# Altium schematic sheet DMotor_Schematic_page1.SchDoc
size 420 x 297 mm; Author: Дубатовка В.В.; Address1: Address1; Address2: Address2; Address3: Address3; Address4: Address4; DocumentNumber: АБВГ.123456.001 Э3; SheetNumber: 1; SheetTotal: 3; Scale: 1:1; DocumentType: Схема электрическая принципиальная; FirstReferrence: АБВГ.123456.001
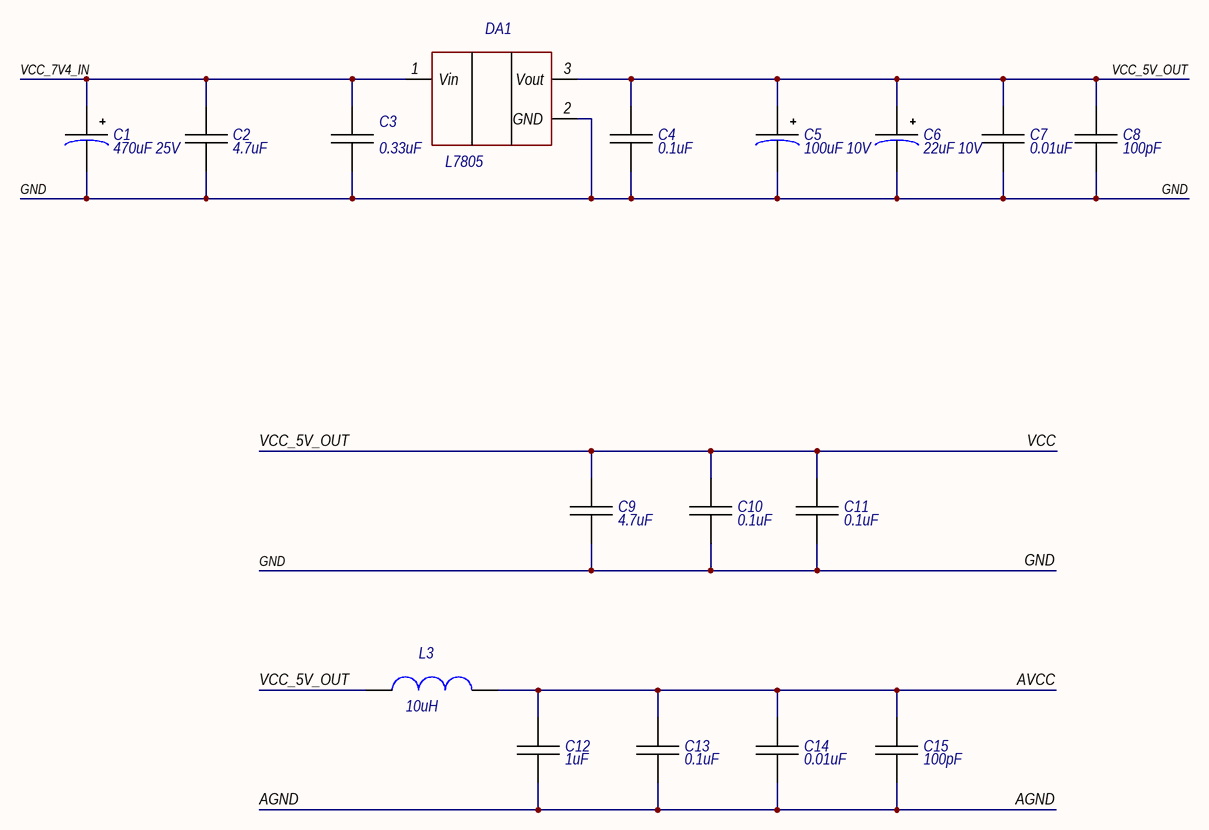
[diagram p0: DMotor_Schematic_page1.SchDoc]

## Parts
C1  470uF 25V  [CapElec_8x16_3.5mm]
C2  4.7uF  [C0603]
C3  0.33uF  [C0603]
C4  0.1uF  [C0603]
C5  100uF 10V  [CapElec_5x11_2mm]
C6  22uF 10V  [TANT-B]
C7  0.01uF  [C0603]
C8  100pF  [C0603]
C9  4.7uF  [C0603]
C10  0.1uF  [C0603]
C11  0.1uF  [C0603]
C12  1uF  [C0603]
C13  0.1uF  [C0603]
C14  0.01uF  [C0603]
C15  100pF  [C0603]
DA1  L7805  [TO-220A]
L3  10uH  [IND1206]

## Nets
AGND: C12.2 C13.2 C14.2 C15.2
AVCC: C12.1 C13.1 C14.1 C15.1 L3.2
GND: C1.2 C2.2 C3.2 C4.2 C5.2 C6.2 C7.2 C8.2 C9.2 C10.2 C11.2 DA1.2(GND)
VCC: C4.1 C5.1 C6.1 C7.1 C8.1 C9.1 C10.1 C11.1 DA1.3(Vout) L3.1  [also labelled VCC_5V_OUT]
VCC_7V4_IN: C1.1 C2.1 C3.1 DA1.1(Vin)

## Notes on the sheet
- Перв. примен.
- Справ. №
- Подп. и дата
- Инв. № дубл.
- Взам. инв. №
- Разраб.
- Изм.
- Лист
- № докум.
- Подп.
- Дата
- Лит.
- Масса
- Масштаб
- Пров.
- Т.контр.
- Листов
- Инв. № подл.
- Утв.
- Н.контр.
- 2.106-A3
- Копировал
- Формат А3

## Library data of the parts
C1 = Capacitor_Elec: Manufacturer: JB; Model: 25V 20%; Value: 470uF 25V; HelpURL: https://www.chipdip.by/product0/9000565915; Case: 8x16_3.5mm
C2 C9 = Capasitor: Manufacturer: Murata; Model: GRM188R61A475K; Value: 4.7uF; Case: C0603; HelpURL: https://www.chipdip.by/product0/9000193550
C3 = Capasitor: Manufacturer: RUF; Value: 0.33uF; Case: C0603; HelpURL: https://belchip.by/product/?selected_product=01610; Model: *
C4 = Capasitor: X7R 50В 10% 0603; Manufacturer: Murata; Model: GRM188R71H104K; Value: 0.1uF; Case: C0603; HelpURL: https://www.chipdip.by/product/grm188r71h104k
C5 = Capacitor_Elec: Manufacturer: JB; Model: 10V 20%; Value: 100uF 10V; HelpURL: https://www.chipdip.by/product0/9000565886; Case: 5x11_2mm
C6 = Capasitor_Tantalum: Model: 10V 10%; Value: 22uF 10V; Case: TANT-B; Manufacturer: -; HelpURL: https://www.chipdip.by/product0/9000502415
C7 = Capasitor: Manufacturer: Murata; Model: X7R 50В 10% 0603; Value: 0.01uF; Case: C0603; HelpURL: https://www.chipdip.by/product/grm188r71h103k
C8 = Capasitor: Manufacturer: Murata; Model: NPO 50В 5% 0603; Value: 100pF; Case: C0603; HelpURL: https://www.chipdip.by/product/grm1885c1h101j
C10 C11 C13 = Capasitor: Manufacturer: Murata; Model: GRM188R71H104K; Value: 0.1uF; Case: C0603; HelpURL: https://www.chipdip.by/product/grm188r71h104k
C12 = Capasitor: X7R 1мкФ 16В 10% 0603; Manufacturer: Murata; Model: GRM188R71C105KA12D; Value: 1uF; Case: C0603; HelpURL: https://www.chipdip.by/product/grm188r71c105ka12d
C14 C15 = Capasitor: Case: C0603; Manufacturer: *; HelpURL: *; Model: *
  C14: Value: 0.01uF
  C15: Value: 100pF
DA1 = L75xx: Linear Voltage Regulator IC  1 Output  1.5A TO-220AB; Manufacturer: STMicroelectronics; Case: TO-220; HelpURL: https://www.chipdip.by/product/l7805acv-dg; Model: L7805
L3 = Inductivity: Manufacturer: Murata; Model: LQH31CN100K03L; HelpURL: https://www.chipdip.by/product/lqh31cn100k03l; Case: IND1206; Value: 10uH